# Altium schematic sheet STD_Protect.SchDoc: =SheetTitle
size A4; SheetTitle: Standard Bus Protection; DrawnBy: Samyar Sadat Akhavi; SheetNumber: 16; SheetTotal: 19
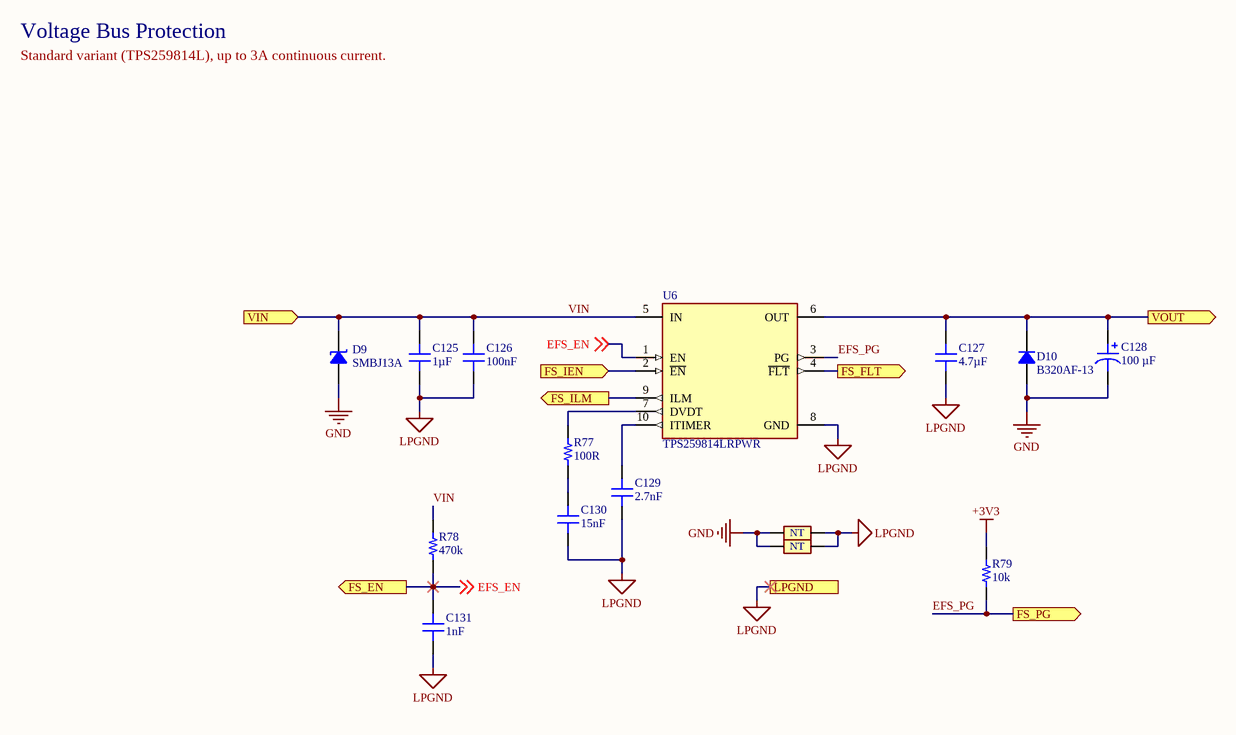
[diagram p0: STD_Protect.SchDoc]

## Parts
?  (no value)  (graphical)
C125  1µF  [CAP 0603_1608]
C126  100nF  [CAP 0603_1608]
C127  4.7µF  [CAP 1206_3216]
C128  100 µF  [CAP ALSMD 6.6MM H7.7MM]
C129  2.7nF  [CAP 0603_1608]
C130  15nF  [CAP 0603_1608]
C131  1nF  [CAP 0603_1608]
D9  SMBJ13A  [DO214AA SMB]
D10  B320AF-13  [DIODES INC SMAF]
NT10  Net Tie  [Net_Tie_Via]  (value not drawn)  (net tie, no BOM)
NT11  Net Tie  [Net_Tie_Via]  (value not drawn)  (net tie, no BOM)
R77  100R  [RES 0603_1608]
R78  470k  [RES 0603_1608]
R79  10k  [RES 0603_1608]
U6  TPS259814LRPWR  [VQFN10_RPW_TEX]

## Ports
FS_EN (out, see Voltage_Regulators[2D]), FS_FLT (out, see Voltage_Regulators[3D]), FS_IEN (in, see Voltage_Regulators[2D]), FS_ILM (out, see Voltage_Regulators[2D]), FS_PG (out, see Voltage_Regulators[3D]), LPGND (see Voltage_Regulators[2D]), VIN (in, see Voltage_Regulators[2D]), VOUT (out, see Voltage_Regulators[3D])

## Nets
+3V3: R79.1
GND: C128.2 D9.1 D10.2 NT10.1 NT11.1
LPGND: C125.1 C126.1 C127.1 C129.1 C130.1 C131.1 NT10.2 NT11.2 U6.8(GND) ; port LPGND
EFS_EN: C131.2 R78.1 U6.1(EN) ; off-sheet EFS_EN, port FS_EN
EFS_PG: R79.2 U6.3(PG) ; port FS_PG
FS_FLT: U6.4(~{FLT}) ; port FS_FLT
FS_IEN: U6.2(~{EN}) ; port FS_IEN
FS_ILM: U6.9(ILM) ; port FS_ILM
VIN: C125.2 C126.2 D9.2 R78.2 U6.5(IN) ; port VIN
VOUT: C127.2 C128.1 D10.1 U6.6(OUT) ; port VOUT
NetC129_2: C129.2 U6.10(ITIMER)
NetC130_2: C130.2 R77.2
NetR77_1: R77.1 U6.7(DVDT)

## Notes on the sheet
- Voltage Bus Protection
- Standard variant (TPS259814L), up to 3A continuous current.
- Sub-Project:
- Size:
- Drawn By:
- Revision:
- Date:
- File:
- Sheet:
- of
- (in symbol GEN-PCBVINT0S3) NT

## Library data of the parts
? = SGR-STDTBSA4: STANDARD SCHEMATICS TITLE BLOCK
C125 = GEN-CC1UT10V25KX7R603: GENERIC 0603 MLC CAPACITOR; Tolerance: ±10%; Voltage: 25V; Dielectric: X7R; Part Number: GEN-CC1UT10V25KX7R603; Value: 1µF
C126 = GEN-CC100NT10V50KX7R603: GENERIC 0603 MLC CAPACITOR; Tolerance: ±10%; Voltage: 50V; Dielectric: X7R; Part Number: GEN-CC100NT10V50KX7R603; Value: 100nF
C127 = GEN-CC4U7T10V25KX7R1206: GENERIC 1206 MLC CAPACITOR; Tolerance: ±10%; Voltage: 25V; Dielectric: X7R; Part Number: GEN-CC4U7T10V25KX7R1206; Value: 4.7µF
C128 = 865080445010: CAP ALUM 100UF 20% 25V SMD; manufacturer: Würth Elektronik; Impedance: 380 mOhms; Lifetime @ Temp.: 2000 Hrs @ 105°C; Polarization: Polar; Ripple Current @ High Frequency: 290 mA @ 100 kHz; Ripple Current @ Low Frequency: 188.5 mA @ 120 Hz; Surface Mount Land Size: 0.260" L x 0.260" W (6.60mm x 6.60mm); Part Number: 865080445010; Applications: General Purpose; Capacitance: 100 µF; componentlink1description: Datasheet; componentlink1url: https://katalog.we-online.de/pbs/datasheet/865080445010.pdf; componentlink2description: DigiKey Link; componentlink2url: https://www.digikey.com/en/products/detail/würth-elektronik/865080445010/5728033; Device Package: Radial, Can - SMD; Height - Seated (Max): 0.303" (7.70mm); lastupdated: 4/5/2026 8:54:41 PM; Lifecycle Status: Active; Minimum Order: 1; Mounting Type: Surface Mount; Operating Temperature: -55°C ~ 105°C; Package / Case: Radial, Can - SMD; packaging: TapeAndReel; partid: 8228; Part Status: Active; price: 0.16; series: WCAP-ASLI; Size / Dimension: 0.248" Dia (6.30mm); Supplier 1: DigiKey; Supplier Part Number 1: 732-8438-1-ND; Tolerance: ±20%; value: 100 µF; Voltage - Rated: 25 V
C129 = GEN-CC2N7T10V50KX7R603: GENERIC 0603 MLC CAPACITOR; Tolerance: ±10%; Voltage: 50V; Dielectric: X7R; Part Number: GEN-CC2N7T10V50KX7R603; Value: 2.7nF
C130 = GEN-CC15NT5V16KX7R603: GENERIC 0603 MLC CAPACITOR; Tolerance: ±5%; Voltage: 16V; Dielectric: X7R; Part Number: GEN-CC15NT5V16KX7R603; Value: 15nF
C131 = GEN-CC1NT10V16KX7R603: GENERIC 0603 MLC CAPACITOR; Tolerance: ±10%; Voltage: 16V; Dielectric: X7R; Part Number: GEN-CC1NT10V16KX7R603; Value: 1nF
D9 = SMBJ13A: TVS DIODE 13VWM 21.5VC DO214AA; Manufacturer: Bourns Inc.; Current - Peak Pulse (10/1000µs): 28A; Power Line Protection: No; Power - Peak Pulse: 600W; Type: Zener; Unidirectional Channels: 1; Voltage - Breakdown (Min): 14.4V; Voltage - Clamping (Max) @ Ipp: 21.5V; Voltage - Reverse Standoff (Typ): 13V; Part Number: SMBJ13A; Applications: General Purpose; ComponentLink1Description: Datasheet; ComponentLink1URL: https://www.bourns.com/docs/Product-Datasheets/SMBJ.pdf; ComponentLink2Description: DigiKey Link; ComponentLink2URL: https://www.digikey.com/en/products/detail/bourns-inc/SMBJ13A/2254626; LastUpdated: 4/5/2026 8:33:25 PM; Lifecycle Status: Active; Minimum Order: 1; Mounting Type: Surface Mount; Operating Temperature: -55°C ~ 150°C (TJ); Package / Case: DO-214AA, SMB; Packaging: TapeAndReel; PartId: 10876; Part Status: Active; Price: 0.08; Series: SMBJ; Supplier 1: DigiKey; Supplier Part Number 1: SMBJ13ABCT-ND; Supplier Device Package: DO-214AA (SMB)
D10 = B320AF-13: DIODE SCHOTTKY 20V 3A SMAF; Manufacturer: Diodes Incorporated; Capacitance @ Vr, F: 140pF @ 4V, 1MHz; Current - Reverse Leakage @ Vr: 200 µA @ 20 V; Speed: Fast Recovery =< 500ns, > 200mA (Io); Voltage - Forward (Vf) (Max) @ If: 500 mV @ 3 A; Part Number: B320AF-13; ComponentLink1Description: Datasheet; ComponentLink1URL: https://www.diodes.com/assets/Datasheets/B320AF-B330AF.pdf; ComponentLink2Description: DigiKey Link; ComponentLink2URL: https://www.digikey.com/en/products/detail/diodes-incorporated/B320AF-13/7666773; Current - Average Rectified (Io): 3A; Diode Type: Schottky; LastUpdated: 4/5/2026 9:05:15 PM; Lifecycle Status: Active; Minimum Order: 1; Mounting Type: Surface Mount; Operating Temperature - Junction: -55°C ~ 150°C; Package / Case: DO-221AC, SMA Flat Leads; Packaging: TapeAndReel; PartId: 3424; Part Status: Active; Price: 0.05; Series: -; Supplier 1: DigiKey; Supplier Part Number 1: B320AF-13DICT-ND; Supplier Device Package: SMAF; Voltage - DC Reverse (Vr) (Max): 20 V
NT10 NT11 = GEN-PCBVINT0S3: VIA STYLE CIRCULAR NET TIE; Part Number: GEN-PCBVINT0S3; Size Variant: 0.3mm
R77 = GEN-CRR100T1P8603: GENERIC 0603 CHIP RESISTOR; Tolerance: ±1%; Power: 0.125W; Part Number: GEN-CRR100T1P8603; Value: 100R
R78 = GEN-CRR470KT1P8603: GENERIC 0603 CHIP RESISTOR; Tolerance: ±1%; Power: 0.125W; Part Number: GEN-CRR470KT1P8603; Value: 470k
R79 = GEN-CRR10KT1P8603: GENERIC 0603 CHIP RESISTOR; Tolerance: ±1%; Power: 0.125W; Part Number: GEN-CRR10KT1P8603; Value: 10k
U6 = TPS259814LRPWR: 2.7-V TO 16-V, 10-A, 6-M EFUSE W; Manufacturer: Texas Instruments; Copyright: Copyright (C) 2026 Ultra Librarian. All rights reserved.; Part Number: TPS259814LRPWR; Supplier 1: DigiKey; Supplier Part Number 1: 296-TPS259814LRPWRCT-ND